# EasyEDA schematic MCPICKUP.json
TITLE: Sheet_1; REV: 1.0; Date: 2023-10-18; Sheet: 1/1; Company: Your Company
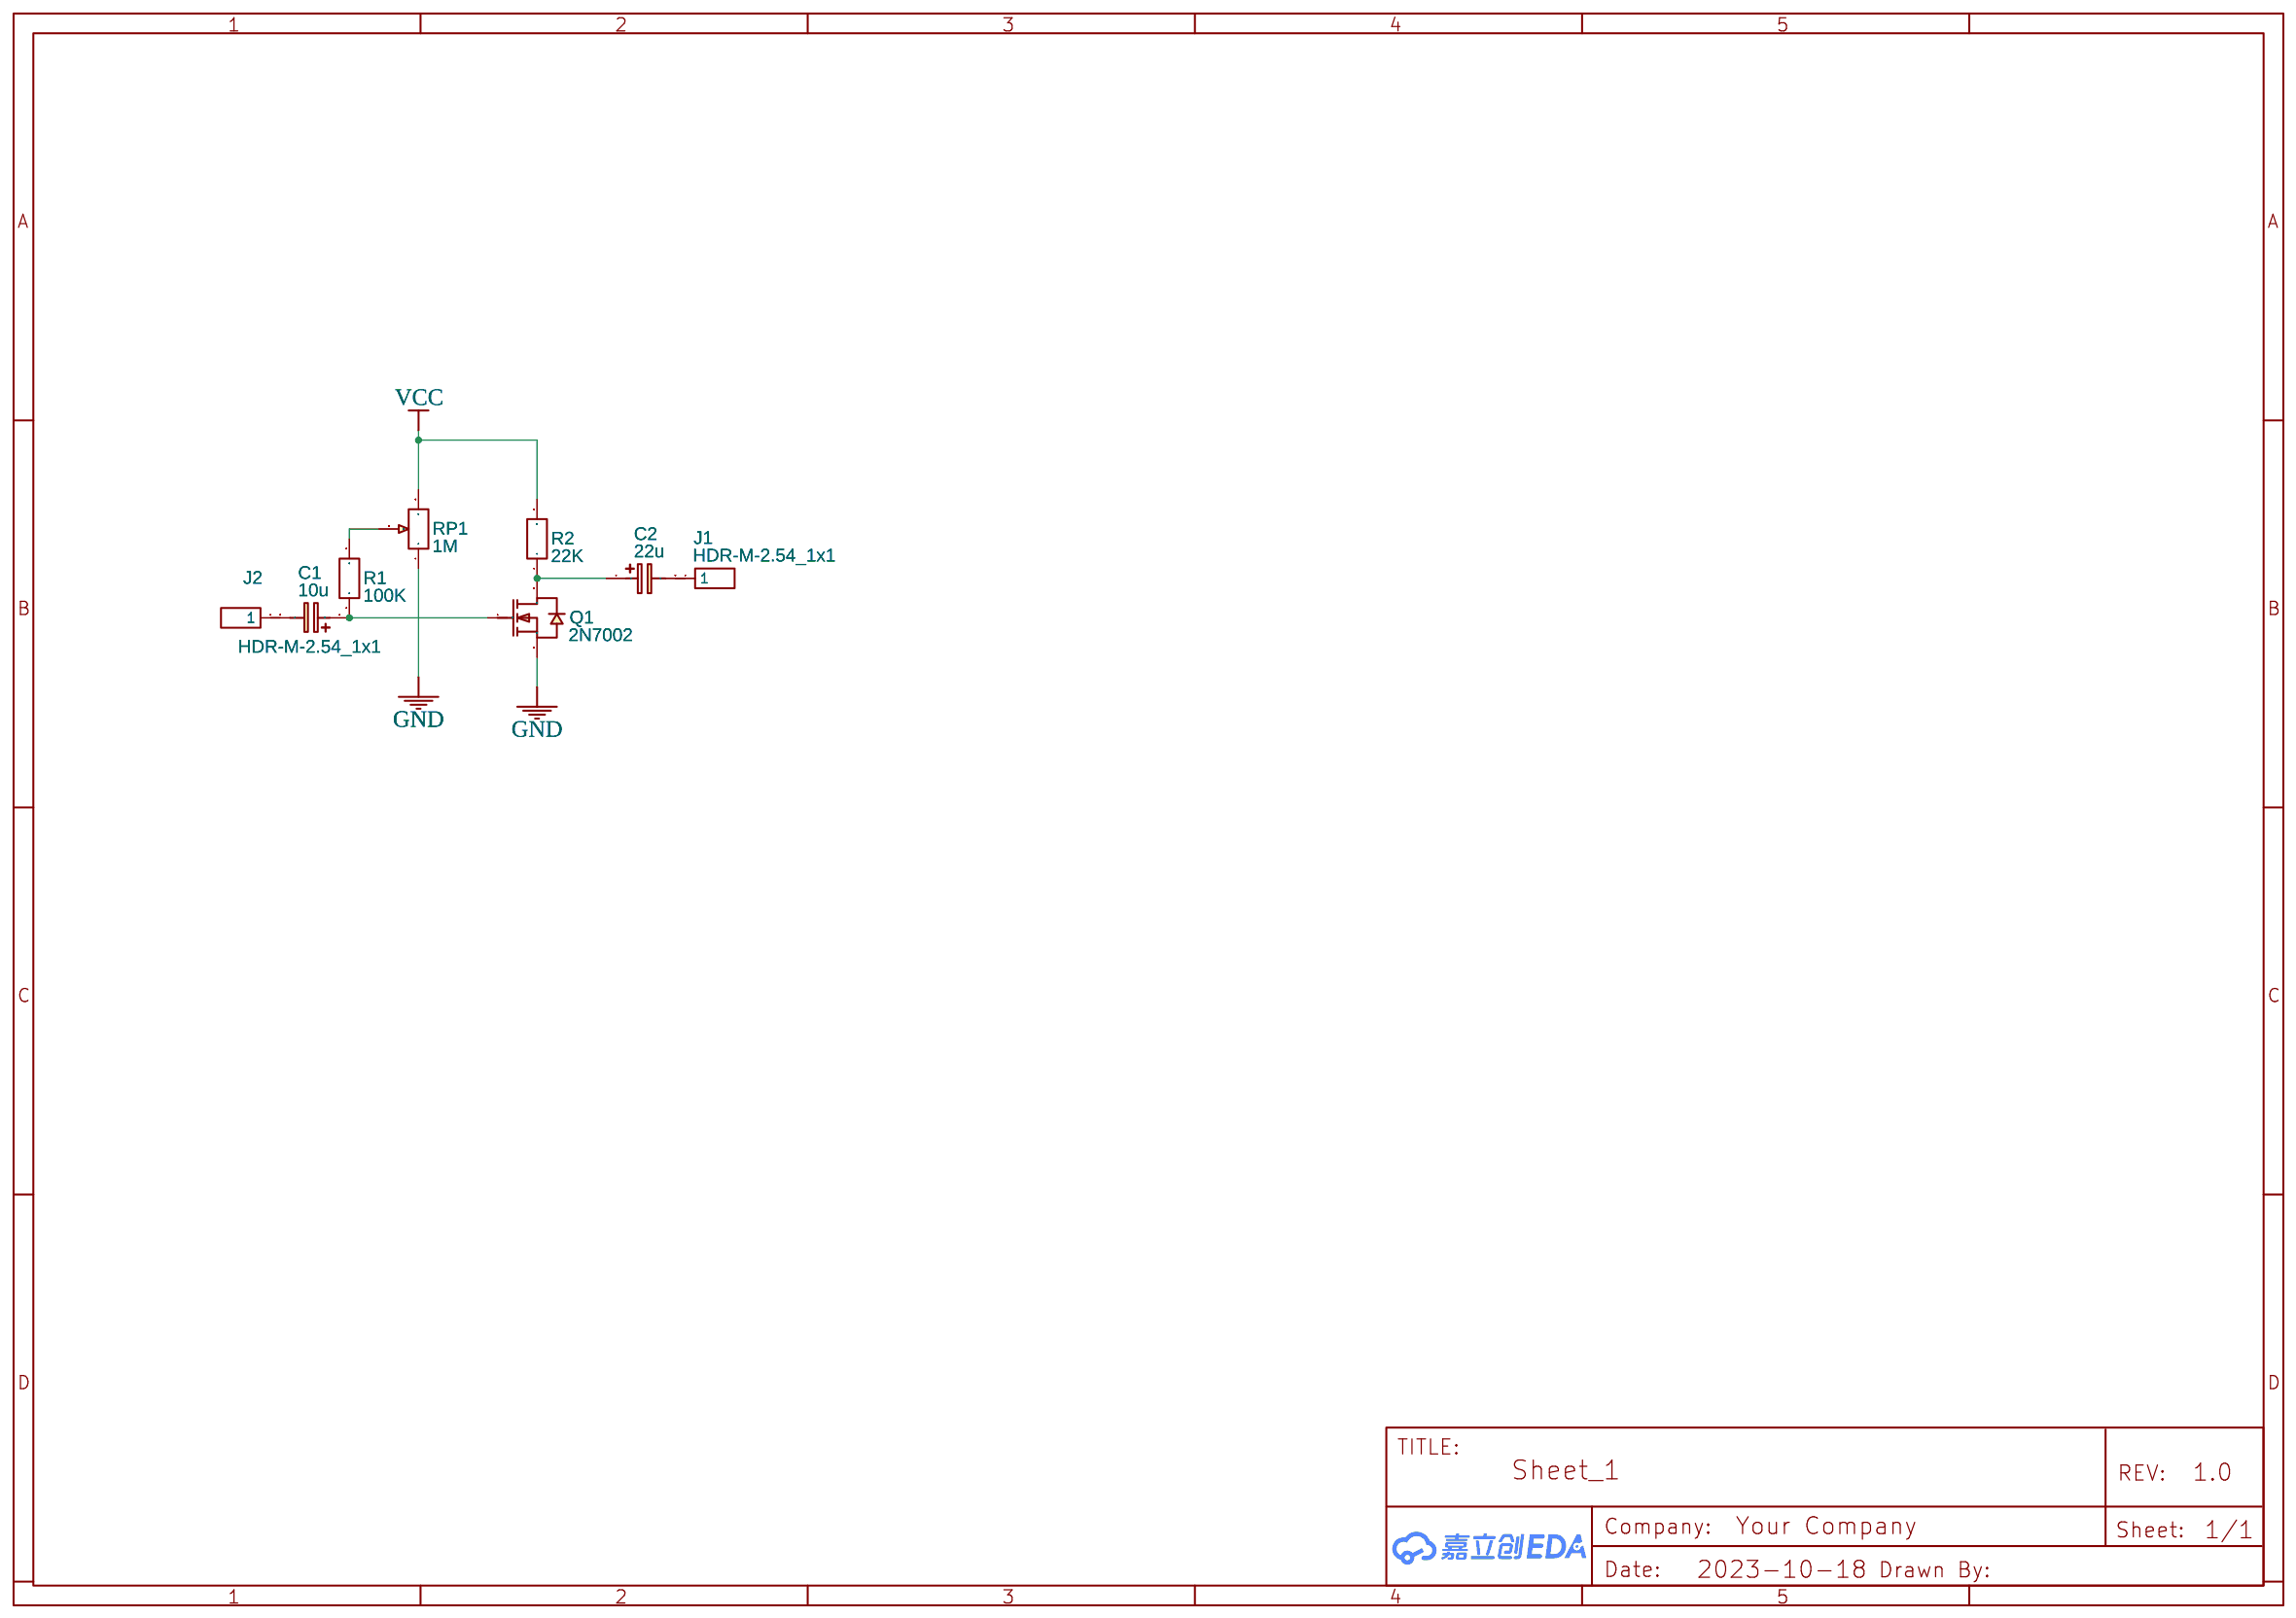
[diagram p0: schematic sheet]

## Parts
C1  10u  [CASE-A_3216]
C2  22u  [CASE-A_3216]
J1  HDR-M-2.54_1x1  [HDR-M-2.54_1X1]
J2  HDR-M-2.54_1x1  [HDR-M-2.54_1X1]
Q1  2N7002  [SOT-23_L2.9-W1.3-P0.95-LS2.4-BR]
R1  100K  [R0603]
R2  22K  [R0603]
RP1  1M  [RES-ADJ-TH_3296W]

## Library data of the parts
C1 C2 = C_Tan_SMD_A_EU: Contributor: LCEDA_Lib
J1 J2 = HDR-M-2.54_1x1: Supplier Part: C81276; Supplier: LCSC; Contributor: LCEDA_Lib
Q1 = 2N7002: Supplier: LCSC; Manufacturer: Nexperia; Manufacturer Part: 2N7002,215; image: //image.lceda.cn/szlcsc/C65189.jpg; Supplier Part: C65189; Paste Type: expand; Contributor: LCEDA_Lib
R1 R2 = R_0603_EU: Contributor: LCEDA_Lib
RP1 = R_3296W_EU: Supplier: LCSC; Contributor: LCEDA_Lib; Value(Ω): 10k

## Nets
GND: Q1.2(S) RP1.1
VCC: R2.2 RP1.3
Net-(C1-1): C1.1 Q1.1(G) R1.1
Net-(C2-1): C2.1 Q1.3(D) R2.1
Net-(R1-2): R1.2 RP1.2

Not connected (* = marked no-connect by the designer): C1 2; C2 2; J1 1; J2 1
